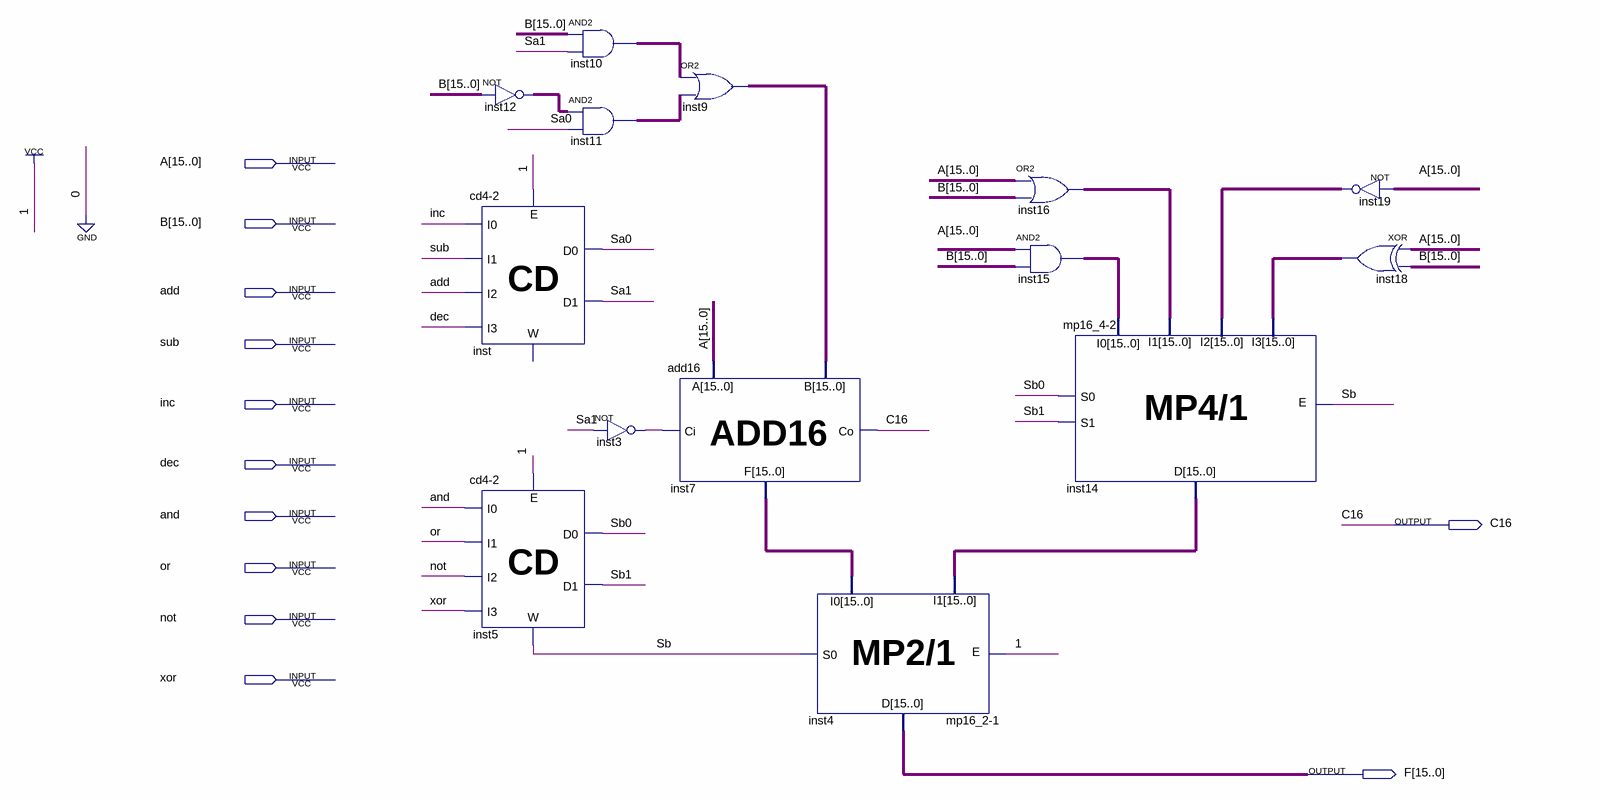
[diagram p0: schematic sheet]
// Quartus schematic ALU.bdf as structural Verilog: 14 symbols, 12 pins
module ALU (
  input  [15:0] A,
  input  [15:0] B,
  input  add,
  input  sub,
  input  inc,
  input  dec,
  input  \and ,
  input  \or ,
  input  \not ,
  input  \xor ,
  output C16,
  output [15:0] F
);

  wire inst3_out, Sa0, Sa1, Sb, Sb0, Sb1;
  wire [15:0] inst7_f, inst9_out, inst10_out, inst11_out, inst12_out, inst14_d, inst15_out, inst16_out,
       inst18_out, inst19_out;

  \cd4-2  inst (.E(1'b1), .I0(inc), .I1(sub), .I2(add), .I3(dec), .D1(Sa1), .D0(Sa0));  // open: W
  \cd4-2  inst5 (.E(1'b1), .I0(\and ), .I1(\or ), .I2(\not ), .I3(\xor ), .D1(Sb1), .D0(Sb0), .W(Sb));
  assign inst12_out = ~B;  // NOT inst12, 16 bits wide
  assign inst10_out = B & {16{Sa1}};  // AND2 inst10, 16 bits wide
  assign inst11_out = inst12_out & {16{Sa0}};  // AND2 inst11, 16 bits wide
  not inst3 (inst3_out, Sa1);
  add16 inst7 (.A(A), .B(inst9_out), .Ci(inst3_out), .F(inst7_f), .Co(C16));
  assign inst9_out = inst10_out | inst11_out;  // OR2 inst9, 16 bits wide
  \mp16_2-1  inst4 (.E(1'b1), .I0(inst7_f), .I1(inst14_d), .S0(Sb), .D(F));
  assign inst16_out = A | B;  // OR2 inst16, 16 bits wide
  assign inst15_out = A & B;  // AND2 inst15, 16 bits wide
  \mp16_4-2  inst14 (
    .E(Sb), .I0(inst15_out), .I1(inst16_out), .I2(inst19_out), .I3(inst18_out), .S0(Sb0), .S1(Sb1),
    .D(inst14_d));
  assign inst19_out = ~A;  // NOT inst19, 16 bits wide
  assign inst18_out = A ^ B;  // XOR inst18, 16 bits wide
endmodule
